# EAGLE schematic nixx (EAGLE 7.7.0)
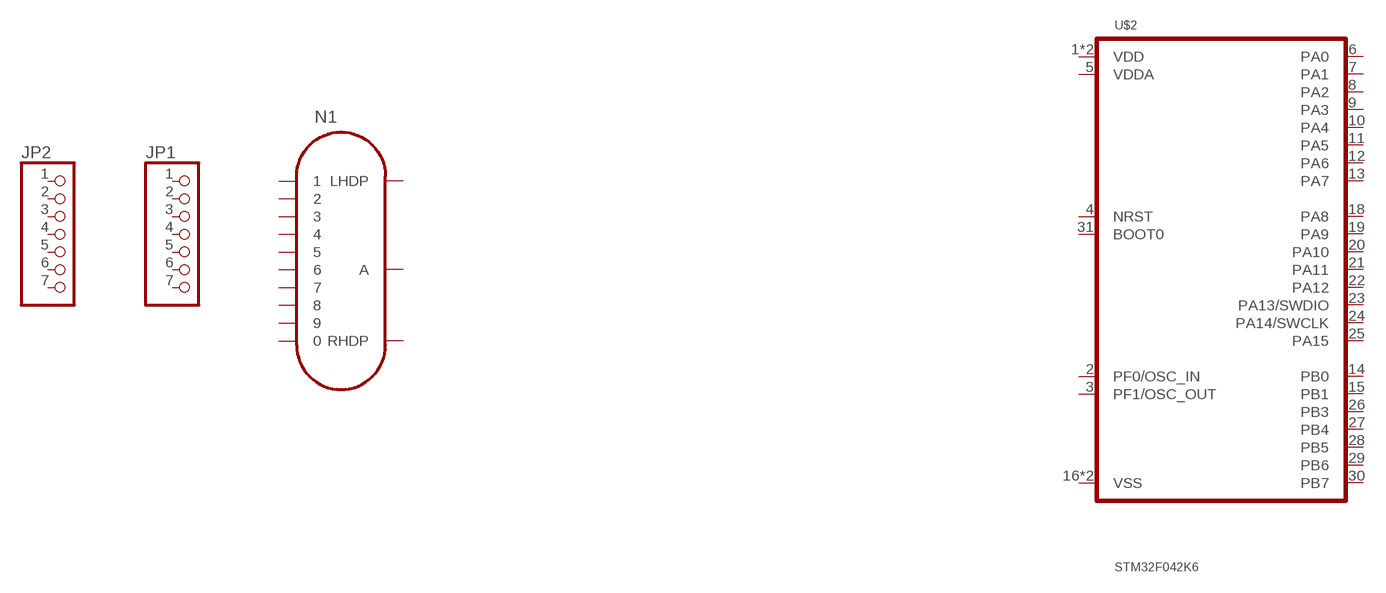
[diagram p0: schematic, sheet 1]

## Parts
JP1  PINHD-1X7  [1X07]
JP2  PINHD-1X7  [1X07]
N1  IN-14  [IN-14]
U$2  STM32F042K6  [TQFP32-08]
Unconnected: JP1.1 JP1.2 JP1.3 JP1.4 JP1.5 JP1.6 JP1.7 JP2.1 JP2.2 JP2.3 JP2.4 JP2.5 JP2.6 JP2.7 N1.0 N1.1 N1.2 N1.3 N1.4 N1.5 N1.6 N1.7 N1.8 N1.9 N1.A N1.LHDP N1.RHDP U$2.1(VDD) U$2.2(PF0/OSC_IN) U$2.3(PF1/OSC_OUT) U$2.4(NRST) U$2.5(VDDA) U$2.6(PA0) U$2.7(PA1) U$2.8(PA2) U$2.9(PA3) U$2.10(PA4) U$2.11(PA5) U$2.12(PA6) U$2.13(PA7) U$2.14(PB0) U$2.15(PB1) U$2.16(VSS) U$2.17(VDD) U$2.18(PA8) U$2.19(PA9) U$2.20(PA10) U$2.21(PA11) U$2.22(PA12) U$2.23(PA13/SWDIO) U$2.24(PA14/SWCLK) U$2.25(PA15) U$2.26(PB3) U$2.27(PB4) U$2.28(PB5) U$2.29(PB6) U$2.30(PB7) U$2.31(BOOT0) U$2.32(VSS)

## Library data of the parts
JP1 JP2 = pinhead:PINHD-1X7: PIN HEADER
N1 = russian-nixies:IN-14: IN-14: medium numeric frontview nixie tube
U$2 = Adafruit Feather M0 Adalogger:STM32F042K6